# Altium schematic sheet SG_5V_Regulator.SchDoc
size A
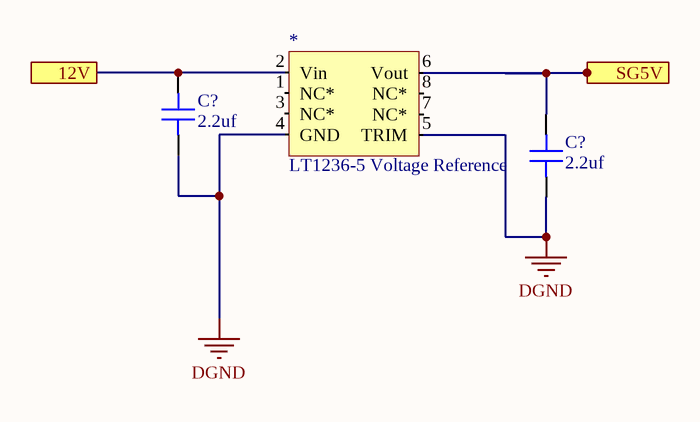
[diagram p0: SG_5V_Regulator.SchDoc]

## Parts
(Parts that share a designator on the sheet are numbered #1, #2 ... from top to bottom, then left to right.)
*  LT1236-5 Voltage Reference  [SOIC-8]
C?#1  value 2.2uf  [CAP 0603/1608]  (hidden comment: Capacitor MLCC 2.2uf 25V CAP 0603/1608)
C?#2  value 2.2uf  [CAP 0603/1608]  (hidden comment: Capacitor MLCC 2.2uf 25V CAP 0603/1608)

## Ports
12V, SG5V

## Nets
DGND: *.4(GND) *.5(TRIM) C?#1.1 C?#2.1
12V: *.2(Vin) C?#1.2 ; port 12V
SG5V: *.6(Vout) C?#2.2 ; port SG5V

Not connected (* = marked no-connect by the designer): * 1(NC*) 3(NC*) 7(NC*) 8(NC*)

## Library data of the parts
* = 2: Manufacturer_id: 1; idIC_Misc: 2; Name: Voltage Ref LT1236-5; Drawer_id: 1
C?#1 C?#2 = 591: Manufacturer_id: 1; idCapacitor: 591; Name: Cap_2.2uf_25V_CAP 0603/1608; Dielectric: Ceramic; Created_By: Nick Mah; Drawer_id: 1; Voltage_Rating: 25V; Package: CAP 0603/1608; Created_Date: 10/20/2018